# EAGLE design Atmega32_Dev (EAGLE 7.2.0)
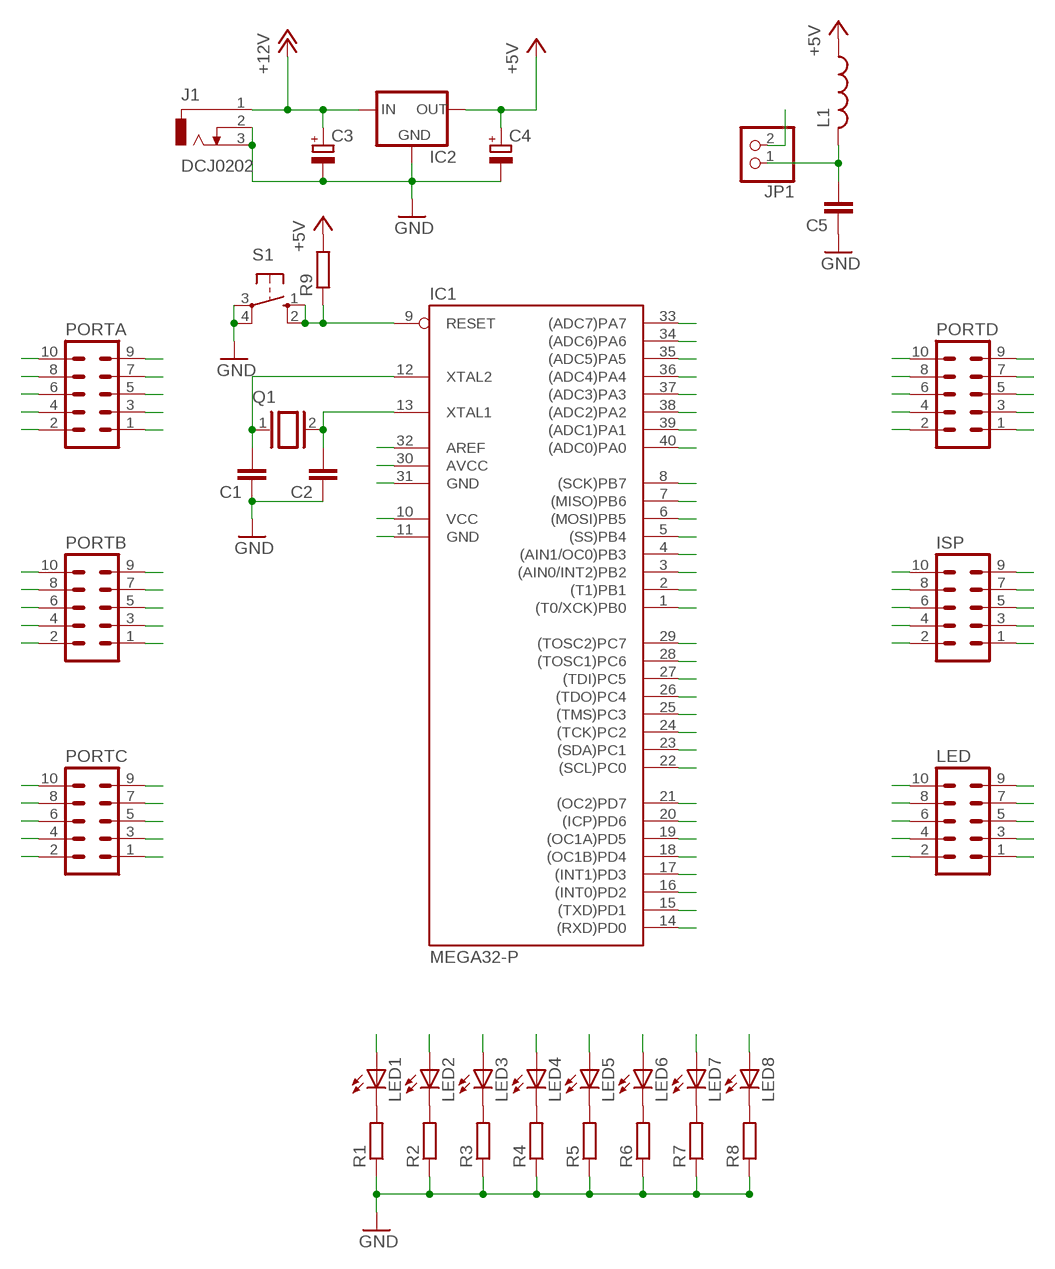
[diagram p0: schematic, sheet 1]

## Parts
C1  CAP1206  [1206]
C2  CAP1206  [1206]
C3  CPOL-EUE5-6  [E5-6]
C4  CPOL-EUE5-6  [E5-6]
C5  CAP1206  [1206]
IC1  MEGA32-P  [DIL40]
IC2  78XXL  [78XXL]
ISP  ML10  [ML10]
J1  DCJ0202  [DCJ0202]
JP1  PINHD-1X2  [1X02]
L1  L-US0204/5  [0204/5]
LED  ML10  [ML10]
LED1  LED3MM  [LED3MM]
LED2  LED3MM  [LED3MM]
LED3  LED3MM  [LED3MM]
LED4  LED3MM  [LED3MM]
LED5  LED3MM  [LED3MM]
LED6  LED3MM  [LED3MM]
LED7  LED3MM  [LED3MM]
LED8  LED3MM  [LED3MM]
PORTA  ML10  [ML10]
PORTB  ML10  [ML10]
PORTC  ML10  [ML10]
PORTD  ML10  [ML10]
Q1  XTAL/S  [QS]
R1  R-EU_M1206  [M1206]
R2  R-EU_M1206  [M1206]
R3  R-EU_M1206  [M1206]
R4  R-EU_M1206  [M1206]
R5  R-EU_M1206  [M1206]
R6  R-EU_M1206  [M1206]
R7  R-EU_M1206  [M1206]
R8  R-EU_M1206  [M1206]
R9  R-EU_0204/7  [0204/7]
S1  10-XX  [B3F-10XX]

## Nets
+5V: C4.+ IC1.10(VCC) IC2.OUT ISP.2 L1.1 LED.9 PORTA.9 PORTB.9 PORTC.9 PORTD.9 R9.2
+12V: C3.+ IC2.IN J1.1
AREF: IC1.32(AREF) JP1.2
AVCC: C5.2 IC1.30(AVCC) JP1.1 L1.2
GND: C1.1 C2.1 C3.- C4.- C5.1 IC1.11(GND) IC1.31(GND) IC2.GND ISP.4 ISP.6 ISP.8 ISP.10 J1.2 J1.3 LED.10 PORTA.10 PORTB.10 PORTC.10 PORTD.10 R1.1 R2.1 R3.1 R4.1 R5.1 R6.1 R7.1 R8.1 S1.3(P) S1.4(P1)
L0: LED1.A LED.1
L1: LED2.A LED.2
L2: LED3.A LED.3
L3: LED4.A LED.4
L4: LED5.A LED.5
L5: LED6.A LED.6
L6: LED7.A LED.7
L7: LED8.A LED.8
N$1: LED1.K(C) R1.2
N$2: LED2.K(C) R2.2
N$3: LED3.K(C) R3.2
N$4: LED4.K(C) R4.2
N$5: LED5.K(C) R5.2
N$6: LED6.K(C) R6.2
N$7: LED7.K(C) R7.2
N$8: LED8.K(C) R8.2
N$44: C1.2 IC1.12(XTAL2) Q1.1
N$45: C2.2 IC1.13(XTAL1) Q1.2
N$63: ISP.3
PA0: IC1.40((ADC0)PA0) PORTA.1
PA1: IC1.39((ADC1)PA1) PORTA.2
PA2: IC1.38((ADC2)PA2) PORTA.3
PA3: IC1.37((ADC3)PA3) PORTA.4
PA4: IC1.36((ADC4)PA4) PORTA.5
PA5: IC1.35((ADC5)PA5) PORTA.6
PA6: IC1.34((ADC6)PA6) PORTA.7
PA7: IC1.33((ADC7)PA7) PORTA.8
PB0: IC1.1((T0/XCK)PB0) PORTB.1
PB1: IC1.2((T1)PB1) PORTB.2
PB2: IC1.3((AIN0/INT2)PB2) PORTB.3
PB3: IC1.4((AIN1/OC0)PB3) PORTB.4
PB4: IC1.5((SS)PB4) PORTB.5
PB5: IC1.6((MOSI)PB5) ISP.9 PORTB.6
PB6: IC1.7((MISO)PB6) ISP.1 PORTB.7
PB7: IC1.8((SCK)PB7) ISP.7 PORTB.8
PC0: IC1.22((SCL)PC0) PORTC.1
PC1: IC1.23((SDA)PC1) PORTC.2
PC2: IC1.24((TCK)PC2) PORTC.3
PC3: IC1.25((TMS)PC3) PORTC.4
PC4: IC1.26((TDO)PC4) PORTC.5
PC5: IC1.27((TDI)PC5) PORTC.6
PC6: IC1.28((TOSC1)PC6) PORTC.7
PC7: IC1.29((TOSC2)PC7) PORTC.8
PD0: IC1.14((RXD)PD0) PORTD.1
PD1: IC1.15((TXD)PD1) PORTD.2
PD2: IC1.16((INT0)PD2) PORTD.3
PD3: IC1.17((INT1)PD3) PORTD.4
PD4: IC1.18((OC1B)PD4) PORTD.5
PD5: IC1.19((OC1A)PD5) PORTD.6
PD6: IC1.20((ICP)PD6) PORTD.7
PD7: IC1.21((OC2)PD7) PORTD.8
RESET: IC1.9(RESET) ISP.5 R9.1 S1.1(S) S1.2(S1)

## Library data of the parts
C1 C2 C5 = SparkFun:CAP: Capacitor Standard 0603 ceramic capacitor, and 0.1" leaded capacitor.
C3 C4 = rcl:CPOL-EU: POLARIZED CAPACITOR, European symbol
IC1 = atmel:MEGA32-P: MICROCONTROLLER 32 Kbytes FLASH 2 Kbytes SRAM 1 Kbytes EEPROM USART 8-channel 10 bit ADC Source: www.atmel.com .. doc2503.pdf; MPN: ATMEGA32-16PU; OC_FARNELL: 1661729; OC_NEWARK: 51P1794
IC2 = v-reg:78XXL: VOLTAGE REGULATOR
ISP LED PORTA PORTB PORTC PORTD = con-harting-ml:ML10: HARTING; OC_FARNELL: unknown; OC_NEWARK: unknown
J1 = con-jack:DCJ0202: DC POWER JACK Source: DCJ0202.pdf; OC_FARNELL: unknown; OC_NEWARK: unknown
JP1 = pinhead:PINHD-1X2: PIN HEADER
L1 = rcl:L-US: INDUCTOR, American symbol
LED1-LED8 = led:LED: LED OSRAM: - CHIPLED LG R971, LG N971, LY N971, LG Q971, LY Q971, LO R971, LY R971 LH N974, LH R974 LS Q976, LO Q976, LY Q976 LO Q996 - Hyper CHIPLED LW Q18S LB Q993, LB Q99A, LB R99A - SideLED LS A670, LO A670, LY A670, LG A670, LP A670 LB A673, LV A673, LT A673, LW A673 LH A674 LY A675 LS A676, LA A676, LO A676, LY A676, LW A676 LS A679, LY A679, LG A679 - Hyper Micro SIDELED® LS Y876, LA Y876, LO Y876, LY Y876 LT Y87S - SmartLED LW L88C, LW L88S LB L89C, LB L89S, LG L890 LS L89K, LO L89K, LY L89K LS L896, LA L896, LO L896, LY L896 - TOPLED LS T670, LO T670, LY T670, LG T670, LP T670 LSG T670, LSP T670, LSY T670, LOP T670, LYG T670 LG T671, LOG T671, LSG T671 LB T673, LV T673, LT T673, LW T673 LH T674 LS T676, LA T676, LO T676, LY T676, LB T676, LH T676, LSB T676, LW T676 LB T67C, LV T67C, LT T67C, LS T67K, LO T67K, LY T67K, LW E67C LS E67B, LA E67B, LO E67B, LY E67B, LB E67C, LV E67C, LT E67C LW T67C LS T679, LY T679, LG T679 LS T770, LO T770, LY T770, LG T770, LP T770 LB T773, LV T773, LT T773, LW T773 LH T774 LS E675, LA E675, LY E675, LS T675 LS T776, LA T776, LO T776, LY T776, LB T776 LHGB T686 LT T68C, LB T68C - Hyper Mini TOPLED® LB M676 - Mini TOPLED Santana® LG M470 LS M47K, LO M47K, LY M47K Source: http://www.osram.convergy.de LUXEON: - LUMILED® LXK2-PW12-R00, LXK2-PW12-S00, LXK2-PW14-U00, LXK2-PW14-V00 LXK2-PM12-R00, LXK2-PM12-S00, LXK2-PM14-U00 LXK2-PE12-Q00, LXK2-PE12-R00, LXK2-PE12-S00, LXK2-PE14-T00, LXK2-PE14-U00 LXK2-PB12-K00, LXK2-PB12-L00, LXK2-PB12-M00, LXK2-PB14-N00, LXK2-PB14-P00, LXK2-PB14-Q00 LXK2-PR12-L00, LXK2-PR12-M00, LXK2-PR14-Q00, LXK2-PR14-R00 LXK2-PD12-Q00, LXK2-PD12-R00, LXK2-PD12-S00 LXK2-PH12-R00, LXK2-PH12-S00 LXK2-PL12-P00, LXK2-PL12-Q00, LXK2-PL12-R00 Source: www.luxeon.com KINGBRIGHT: KA-3528ASYC Source: www.kingbright.com
Q1 = SmartPrj:XTAL/S: CRYSTAL
R1-R8 = resistor:R-EU_: RESISTOR, European symbol
R9 = rcl:R-EU_: RESISTOR, European symbol
S1 = switch-omron:10-XX: OMRON SWITCH; MPN: B3F-1000; OC_FARNELL: 176432; OC_NEWARK: 36M3542

## Board
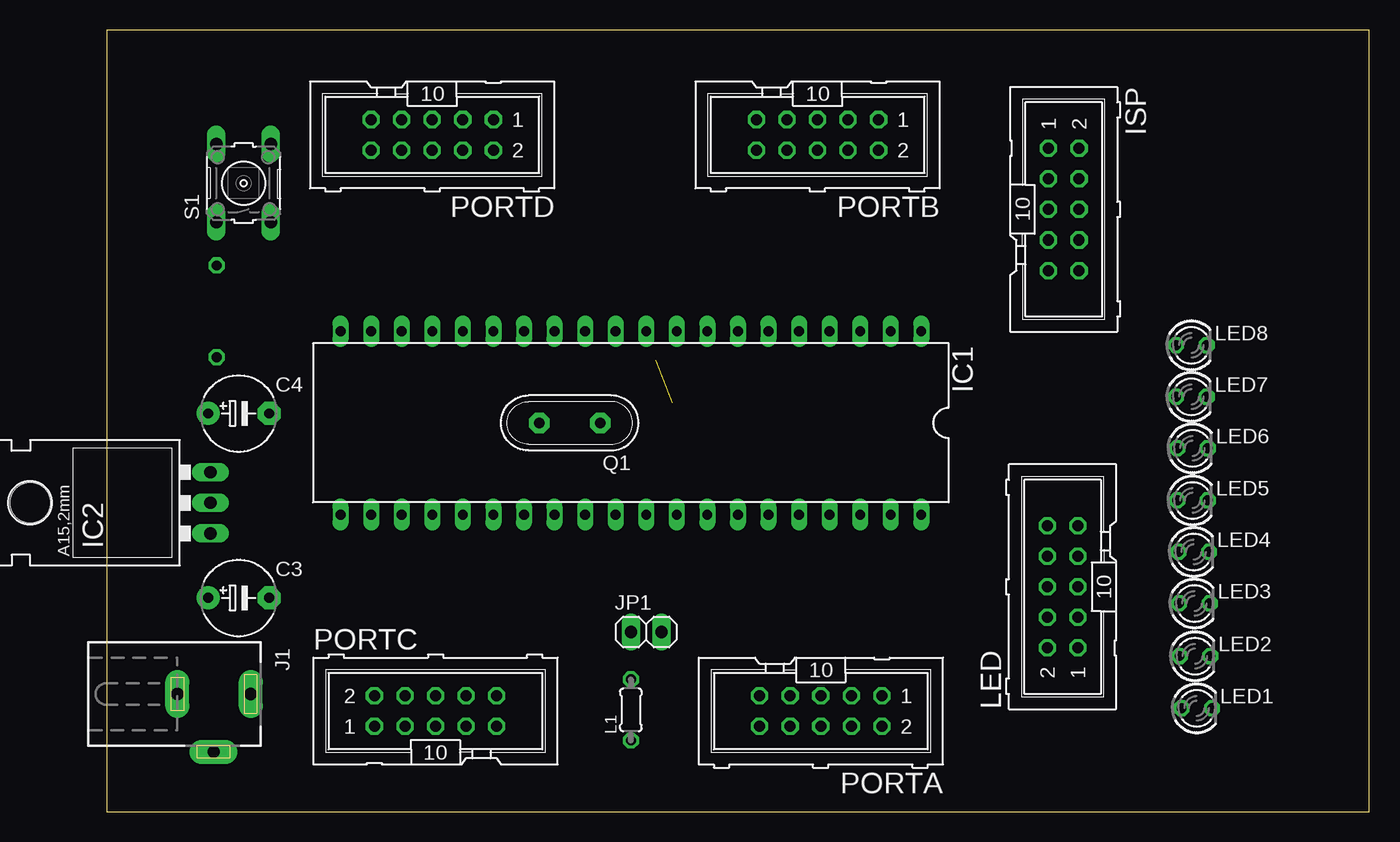
[diagram p1: board, top side]
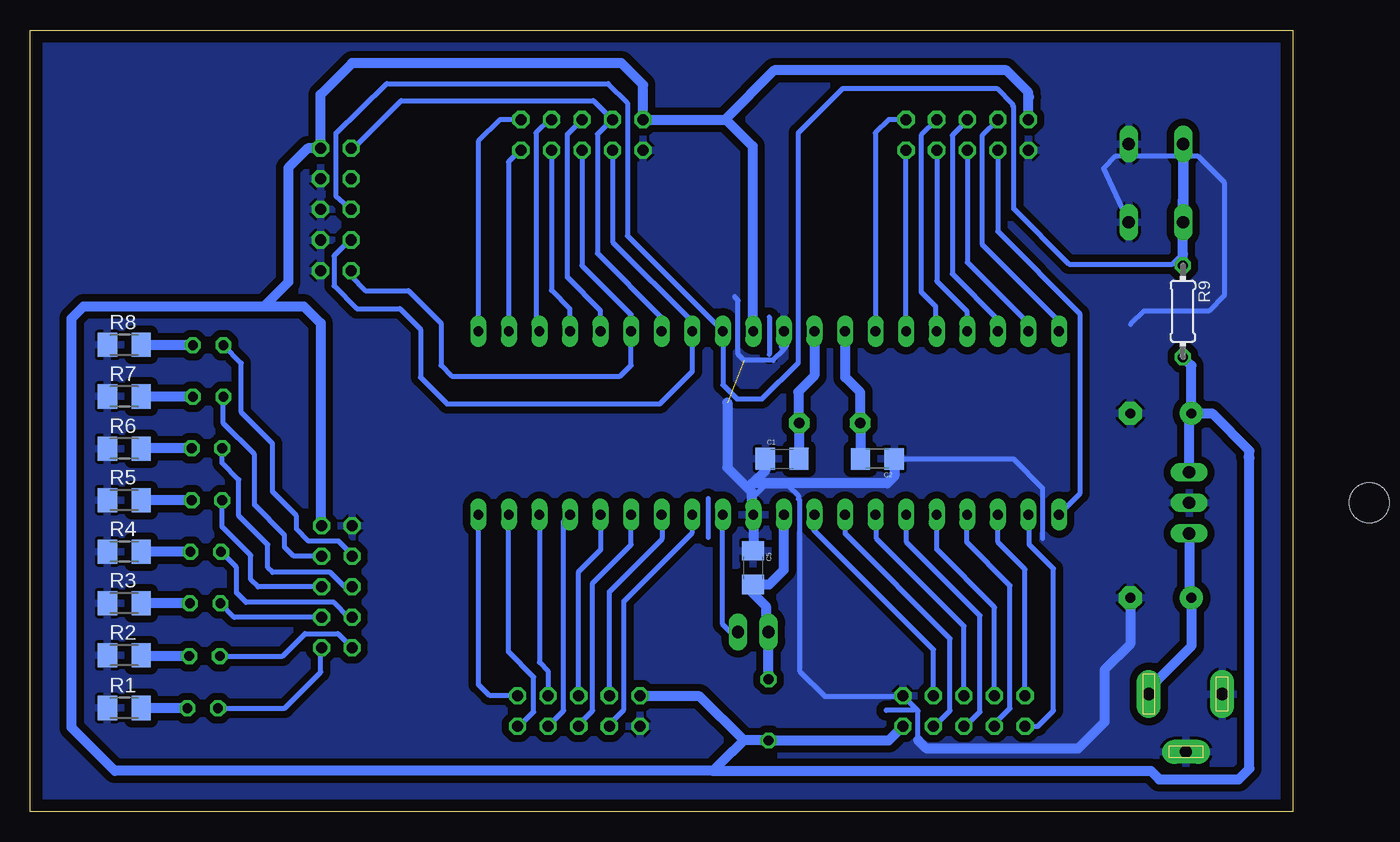
[diagram p2: board, bottom side, seen from below]

Size 104.95 x 64.95 mm. Coordinates in mm from the lower left corner, seen from the top.
Outline: 0,0 104.95,0 104.95,64.95 0,64.95 0,0
Copper layers (1*16): Top 0.035mm / dielectric 1.5mm / Bottom 0.035mm
Design rules "default": minimum track width 10mil, minimum drill 24mil, track to track 8mil, track to pad 8mil, pad to pad 8mil, via to via 8mil, smd to smd 8mil, copper to edge 40mil, drill to drill 8mil, minimum pad ring 10mil, minimum via ring 8mil, stop-mask expansion 4mil, vias tented up to drill 0mil, thermal gap 10mil

### Footprints (pad centres in the part's own frame; a part is rotated, then mirrored left to right if it is on the bottom)
1206 = smd 1.6 x 1.8: 1 -1.4,0; 2 1.4,0
E5-6 = drill 0.813 pad 1.905: + -2.54,0 | drill 0.813 pad 1.905 octagon: - 2.54,0
DIL40 = drill 0.813 long: 1 -24.13,-7.62; 2 -21.59,-7.62; 3 -19.05,-7.62; 4 -16.51,-7.62; 5 -13.97,-7.62; 6 -11.43,-7.62; 7 -8.89,-7.62; 8 -6.35,-7.62; 9 -3.81,-7.62; 10 -1.27,-7.62; 11 1.27,-7.62; 12 3.81,-7.62; 13 6.35,-7.62; 14 8.89,-7.62; 15 11.43,-7.62; 16 13.97,-7.62; 17 16.51,-7.62; 18 19.05,-7.62; 19 21.59,-7.62; 20 24.13,-7.62; 21 24.13,7.62; 22 21.59,7.62; 23 19.05,7.62; 24 16.51,7.62; 25 13.97,7.62; 26 11.43,7.62; 27 8.89,7.62; 28 6.35,7.62; 29 3.81,7.62; 30 1.27,7.62; 31 -1.27,7.62; 32 -3.81,7.62; 33 -6.35,7.62; 34 -8.89,7.62; 35 -11.43,7.62; 36 -13.97,7.62; 37 -16.51,7.62; 38 -19.05,7.62; 39 -21.59,7.62; 40 -24.13,7.62
78XXL = drill 1.016 long: GND 0,-3.81; IN -2.54,-3.81; OUT 2.54,-3.81 | hole 3.302: 0,11.176
ML10 = drill 0.914 octagon: 1 -5.08,-1.27; 2 -5.08,1.27; 3 -2.54,-1.27; 4 -2.54,1.27; 5 0,-1.27; 6 0,1.27; 7 2.54,-1.27; 8 2.54,1.27; 9 5.08,-1.27; 10 5.08,1.27
DCJ0202 = drill 1 pad 2 long: 1 0,3.1; 2 4.8,0; 3 0,-3
1X02 = drill 1.016 long: 1 -1.27,0; 2 1.27,0
0204/5 = drill 0.813 octagon: 1 -2.54,0; 2 2.54,0
LED3MM = drill 0.813 octagon: A -1.27,0; K 1.27,0
QS = drill 0.85 pad 1.676 octagon: 1 -2.54,0; 2 2.54,0
M1206 = smd 1.6 x 2: 1 -1.4,0; 2 1.4,0
0204/7 = drill 0.813 octagon: 1 -3.81,0; 2 3.81,0
B3F-10XX = drill 1.016 long: 1 -3.251,2.261; 2 3.251,2.261; 3 -3.251,-2.261; 4 3.251,-2.261

### Placement (x,y rotation side)
C1  42.45,29.33 0 bottom
C2  34.53,29.32 180 bottom
C3  10.97,17.78 0 top
C4  10.97,33.1 0 top
C5  44.87,20.29 270 bottom
IC1  43.57,32.31 180 top
IC2  4.81,25.67 90 top
ISP  79.55,50.05 270 top
J1  8.88,9.79 270 top
JP1  44.84,14.94 0 top
L1  43.57,8.47 90 top
LED  79.45,18.7 90 top
LED1  90.6,8.61 0 top
LED2  90.45,12.94 0 top
LED3  90.4,17.32 0 top
LED4  90.35,21.6 0 top
LED5  90.25,25.88 0 top
LED6  90.25,30.21 0 top
LED7  90.15,34.49 0 top
LED8  90.15,38.77 0 top
PORTA  59.35,8.37 180 top
PORTB  59.08,56.25 180 top
PORTC  27.33,8.37 0 top
PORTD  27.06,56.25 180 top
Q1  38.49,32.31 180 top
R1  97.12,8.63 0 bottom
R2  97.12,13.01 0 bottom
R3  97.12,17.34 0 bottom
R4  97.12,21.62 0 bottom
R5  97.12,25.9 0 bottom
R6  97.12,30.18 0 bottom
R7  97.12,34.51 0 bottom
R8  97.12,38.79 0 bottom
R9  9.14,41.59 270 bottom
S1  11.38,52.23 90 top

### Tracks (layer width: path | path; a pad name or v marks a point on that pad's centre or on a via)
+5V
  Bottom 0.813: C4.+ 8.62,32.91 IC2.OUT | PORTC.9 33.58,5.93 L1.1 45.63,5.93 | 45.63,5.93 49.3,9.6 54.23,9.6 PORTA.9 | 85.5,42 100.5,42 101.5,41 101.5,7 97.9,3.4 48.2,3.4 | 85.5,42 82.2,42 80.8,40.6 80.8,23.86 LED.9 | C4.+ 6.7,33.1 3.6,30 3.6,29.4 | 85.5,42 83.5,44 83.5,53.5 81.87,55.13 ISP.2 80.82,59.58 78.2,62.2 55.8,62.2 54,60.4 PORTB.9 47.2,57.52 | 45.63,5.93 46.56,5 46.6,5 48.2,3.4 | 48.2,3.4 11.8,3.4 11.1,2.7 4.5,2.7 3.6,3.6 3.6,29.4 | 47.2,57.52 47.12,57.52 44.9,55.3 44.9,39.99 IC1.10 | 21.92,59.38 21.98,59.38 PORTD.9 21.98,59.78 23.8,61.6 43.12,61.6 47.2,57.52 | 3.7,29.5 3.6,29.4 | C4.+ 8.43,37.07 R9.2
+12V
  Bottom 0.813: 8.18,17.53 C3.+ | IC2.IN 8.62,17.97 C3.+ | J1.1 11.98,10.22 8.4,13.8 8.4,17.75 C3.+
AREF
  Bottom 0.406: JP1.2 46.74,14.94 47.4,15.6 47.4,24.67 IC1.32
AVCC
  Bottom 0.813: L1.2 JP1.1 43.8,15.17 43.8,17.1 44.87,18.17 C5.2 43.51,18.89 42.3,20.1 IC1.30
GND  (1 unrouted)
  Bottom 0.406: C5.1 44.87,26.13 43.9,27.1 41.9,27.1 41.1,26.3 41.1,26 41,25.9 41,11.7 38.9,9.6 32.45,9.6 PORTC.10 31.15,8.38 31.15,5.95 | 42.3,38.7 42.3,38.4 43.2,37.5 45.6,37.5 46.1,38 46.1,42.5 46.4,42.8 | C2.1 23.22,29.32 20.8,26.9 20.8,22.7 | S1.3 15.72,53.48 14.7,54.5 7.9,54.5 5.7,52.3 5.7,42.9 7,41.6 12.4,41.6 13.5,40.5
  Bottom 0.813: C5.1 44.84,21.72 IC1.31 45,24.85 45,26.6 45.3,26.9 | IC1.11 42.3,38.7 | 47,34 47,28.6 45.3,26.9 | C1.1 43.85,28.35 44.85,27.35 | 44.85,27.35 45.3,26.9 | C2.1 33.13,27.87 33.7,27.3 44.8,27.3 44.85,27.35 | C3.- 13.51,13.94 15.65,11.8 15.65,7.45 17.85,5.25 30.45,5.25 31.15,5.95
  pour Bottom (isolate 0.61): 0,65 0,0 104.7,-0.1 104.7,64.9
L0
  Bottom 0.406: LED1.A 83.79,8.61 80.8,11.6 80.8,13.54 LED.1
L1
  Bottom 0.406: LED2.A 83.96,12.94 82.1,14.8 79.36,14.8 LED.2
L2
  Bottom 0.406: LED.3 87.97,16.16 LED3.A
L3
  Bottom 0.406: LED.4 78.46,16.16 79.7,17.4 87,17.4 87.8,18.2 87.8,20.32 LED4.A
L4
  Bottom 0.406: LED.5 86,18.7 86.6,19.3 86.6,21.3 89,23.7 89,25.86 LED5.A
L5
  Bottom 0.406: LED.6 78.8,18.7 80,19.9 84.8,19.9 85.2,20.3 85.2,22.2 87.6,24.6 87.6,27.6 89,29 89,30.19 LED6.A
L6
  Bottom 0.406: LED.7 83.04,21.24 83.8,22 83.8,23 86.3,25.5 86.3,29.7 88.9,32.3 88.9,34.47 LED7.A
L7
  Bottom 0.406: LED.8 78.18,21.38 79.3,22.5 81.8,22.5 82.8,23.5 82.8,24.6 84.8,26.6 84.8,30.6 87.4,33.2 87.4,37.29 LED8.A
N$1
  Bottom 0.813: LED1.K 95.7,8.61 R1.2
N$2
  Bottom 0.813: LED2.K 95.65,12.94 R2.2
N$3
  Bottom 0.813: LED3.K 95.7,17.32 R3.2
N$4
  Bottom 0.813: LED4.K 95.7,21.6 R4.2
N$5
  Bottom 0.813: LED5.K 95.7,25.88 R5.2
N$6
  Bottom 0.813: LED6.K 95.69,30.21 R6.2
N$7
  Bottom 0.813: LED7.K 95.7,34.49 R7.2
N$8
  Bottom 0.813: LED8.K 95.7,38.77 R8.2
N$9
  Bottom 0.406: 43.5,41.1 43.5,38
N$10
  Bottom 0.406: 48.6,26.05 48.6,22.8
N$11
  Bottom 0.406: 31.5,8.45 33.8,8.45 33.8,8.4
N$44
  Bottom 0.813: C1.2 41.03,29.35 Q1.1 41.1,32.38 41.1,34.9 39.76,36.24 IC1.12
N$45
  Bottom 0.813: C2.2 35.95,29.34 Q1.2 35.95,34.85 37.2,36.1 37.2,39.91 IC1.13
PA0
  Bottom 0.406: IC1.40 67.7,10.6 66.8,9.7 64.49,9.7 PORTA.1
PA1
  Bottom 0.406: PORTA.2 64.3,7.1 63.1,8.3 63.1,11.2 65.2,13.3 65.2,24.65 IC1.39
PA2
  Bottom 0.406: IC1.38 62.62,12.42 61.9,11.7 PORTA.3
PA3
  Bottom 0.406: PORTA.4 60.6,8.4 60.6,24.17 IC1.37
PA4
  Bottom 0.406: PORTA.5 59.35,19.95 57.5,21.8 57.5,24.65 IC1.36
PA5
  Bottom 0.406: PORTA.6 59.35,7.25 58.2,8.4 58.2,19 55,22.2 IC1.35
PA6
  Bottom 0.406: PORTA.7 56.81,18.29 52.4,22.7 52.4,24.63 IC1.34
PA7
  Bottom 0.406: PORTA.8 56.81,7.29 55.6,8.5 55.6,17.5 49.9,23.2 49.9,24.67 IC1.33
PB0
  Bottom 0.406: PORTB.1 65.88,57.52 67.7,55.7 IC1.1
PB1
  Bottom 0.406: PORTB.2 64.22,54.98 65.2,54 65.2,39.97 IC1.2
PB2
  Bottom 0.406: PORTB.3 61.78,57.52 62.9,56.4 62.9,40.21 IC1.3
PB3
  Bottom 0.406: PORTB.4 61.62,43.32 60.1,41.8 60.1,39.95 IC1.4
PB4
  Bottom 0.406: IC1.5 57.54,41.64 60.3,44.4 60.3,56.3 PORTB.5
PB5
  Bottom 0.406: PORTB.6 59.08,45.38 55,41.3 IC1.6 55,37.1 55.9,36.2 69.9,36.2 70.8,37.1 70.8,40.6 73.5,43.3 77.1,43.3 78.28,44.48 ISP.9
PB6
  Bottom 0.406: IC1.7 52.5,39.97 52.5,41.1 57.8,46.4 57.8,56.3 56.58,57.52 PORTB.7 58.12,59.1 74.1,59.1 78.07,55.13 ISP.1
PB7
  Bottom 0.406: PORTB.8 56.54,47.34 49.9,40.7 49.9,39.95 IC1.8 49.9,39.91 49.9,36.6 52.6,33.9 70.3,33.9 72.5,36.1 72.5,40.1 74.2,41.8 77.8,41.8 79.7,43.7 79.7,46.2 78.39,47.51 ISP.7
PC0
  Bottom 0.406: PORTC.1 21.2,7.1 19.9,8.4 19.9,20.2 21.9,22.2 21.9,24.61 IC1.22
PC1
  Bottom 0.406: PORTC.2 22.25,20.15 24.5,22.4 24.5,24.67 IC1.23
PC2
  Bottom 0.406: PORTC.3 24.79,7.31 23.5,8.6 23.5,18.8 27.1,22.4 27.1,24.65 IC1.24
PC3
  Bottom 0.406: PORTC.4 24.79,16.99 29.6,21.8 IC1.25
PC4
  Bottom 0.406: PORTC.5 27.2,7.1 26,8.3 26,16.3 32.1,22.4 32.1,24.65 IC1.26
PC5
  Bottom 0.406: PORTC.6 27.33,15.43 34.6,22.7 34.6,24.61 IC1.27
PC6
  Bottom 0.406: PORTC.7 29.8,7.1 28.5,8.4 28.5,14.4 37.2,23.1 37.2,24.67 IC1.28
PC7
  Bottom 0.406: PORTC.8 29.87,13.47 39.8,23.4 39.8,24.65 IC1.29
PD0
  Bottom 0.406: PORTD.1 33.58,57.52 34.7,56.4 34.7,39.95 IC1.14
PD1
  Bottom 0.406: IC1.15 PORTD.2
PD2
  Bottom 0.406: PORTD.3 29.6,57.5 30.9,56.2 30.9,43.2 29.7,42 29.7,40.03 IC1.16
PD3
  Bottom 0.406: PORTD.4 29.6,44.1 27.1,41.6 27.1,39.97 IC1.17
PD4
  Bottom 0.406: PORTD.5 27.06,57.44 28.3,56.2 28.3,44.7 24.5,40.9 24.5,39.95 IC1.18
PD5
  Bottom 0.406: PORTD.6 27.06,45.66 21.9,40.5 21.9,40.01 IC1.19
PD6
  Bottom 0.406: 24.52,57.32 PORTD.7 25.8,56.24 25.8,47.1 19.4,40.7 19.4,39.97 IC1.20
PD7
  Bottom 0.406: PORTD.8 24.52,48.22 17.7,41.4 17.7,26.43 IC1.21
RESET
  Bottom 0.406: 9.14,46.36 10,45.5 18.6,45.5 23.2,50.1 23.2,58.6 23.3,58.7 23.3,58.8 24.6,60.1 37.4,60.1 41.1,56.4 41.1,37.3 44.1,34.3 46.2,34.3 47.38,35.48 IC1.9 55.3,47.85 55.3,58.9 56.9,60.5 75.3,60.5 79.55,56.35 79.55,51.17 ISP.5
  Bottom 0.813: R9.1 9.14,46.36 S1.2 S1.1